# Altium schematic sheet [01] - COVER PAGE.SchDoc: COVER PAGE
size A3; Author: Gabriel Piñango; DocumentNumber: 1; Revision: V1I1; SheetNumber: 1; SheetTotal: 6; Collaborator: Gabriel Pinango; Project: MultiTestcard; VersionRevision: V1I1; Designer: Gabriel Pinango
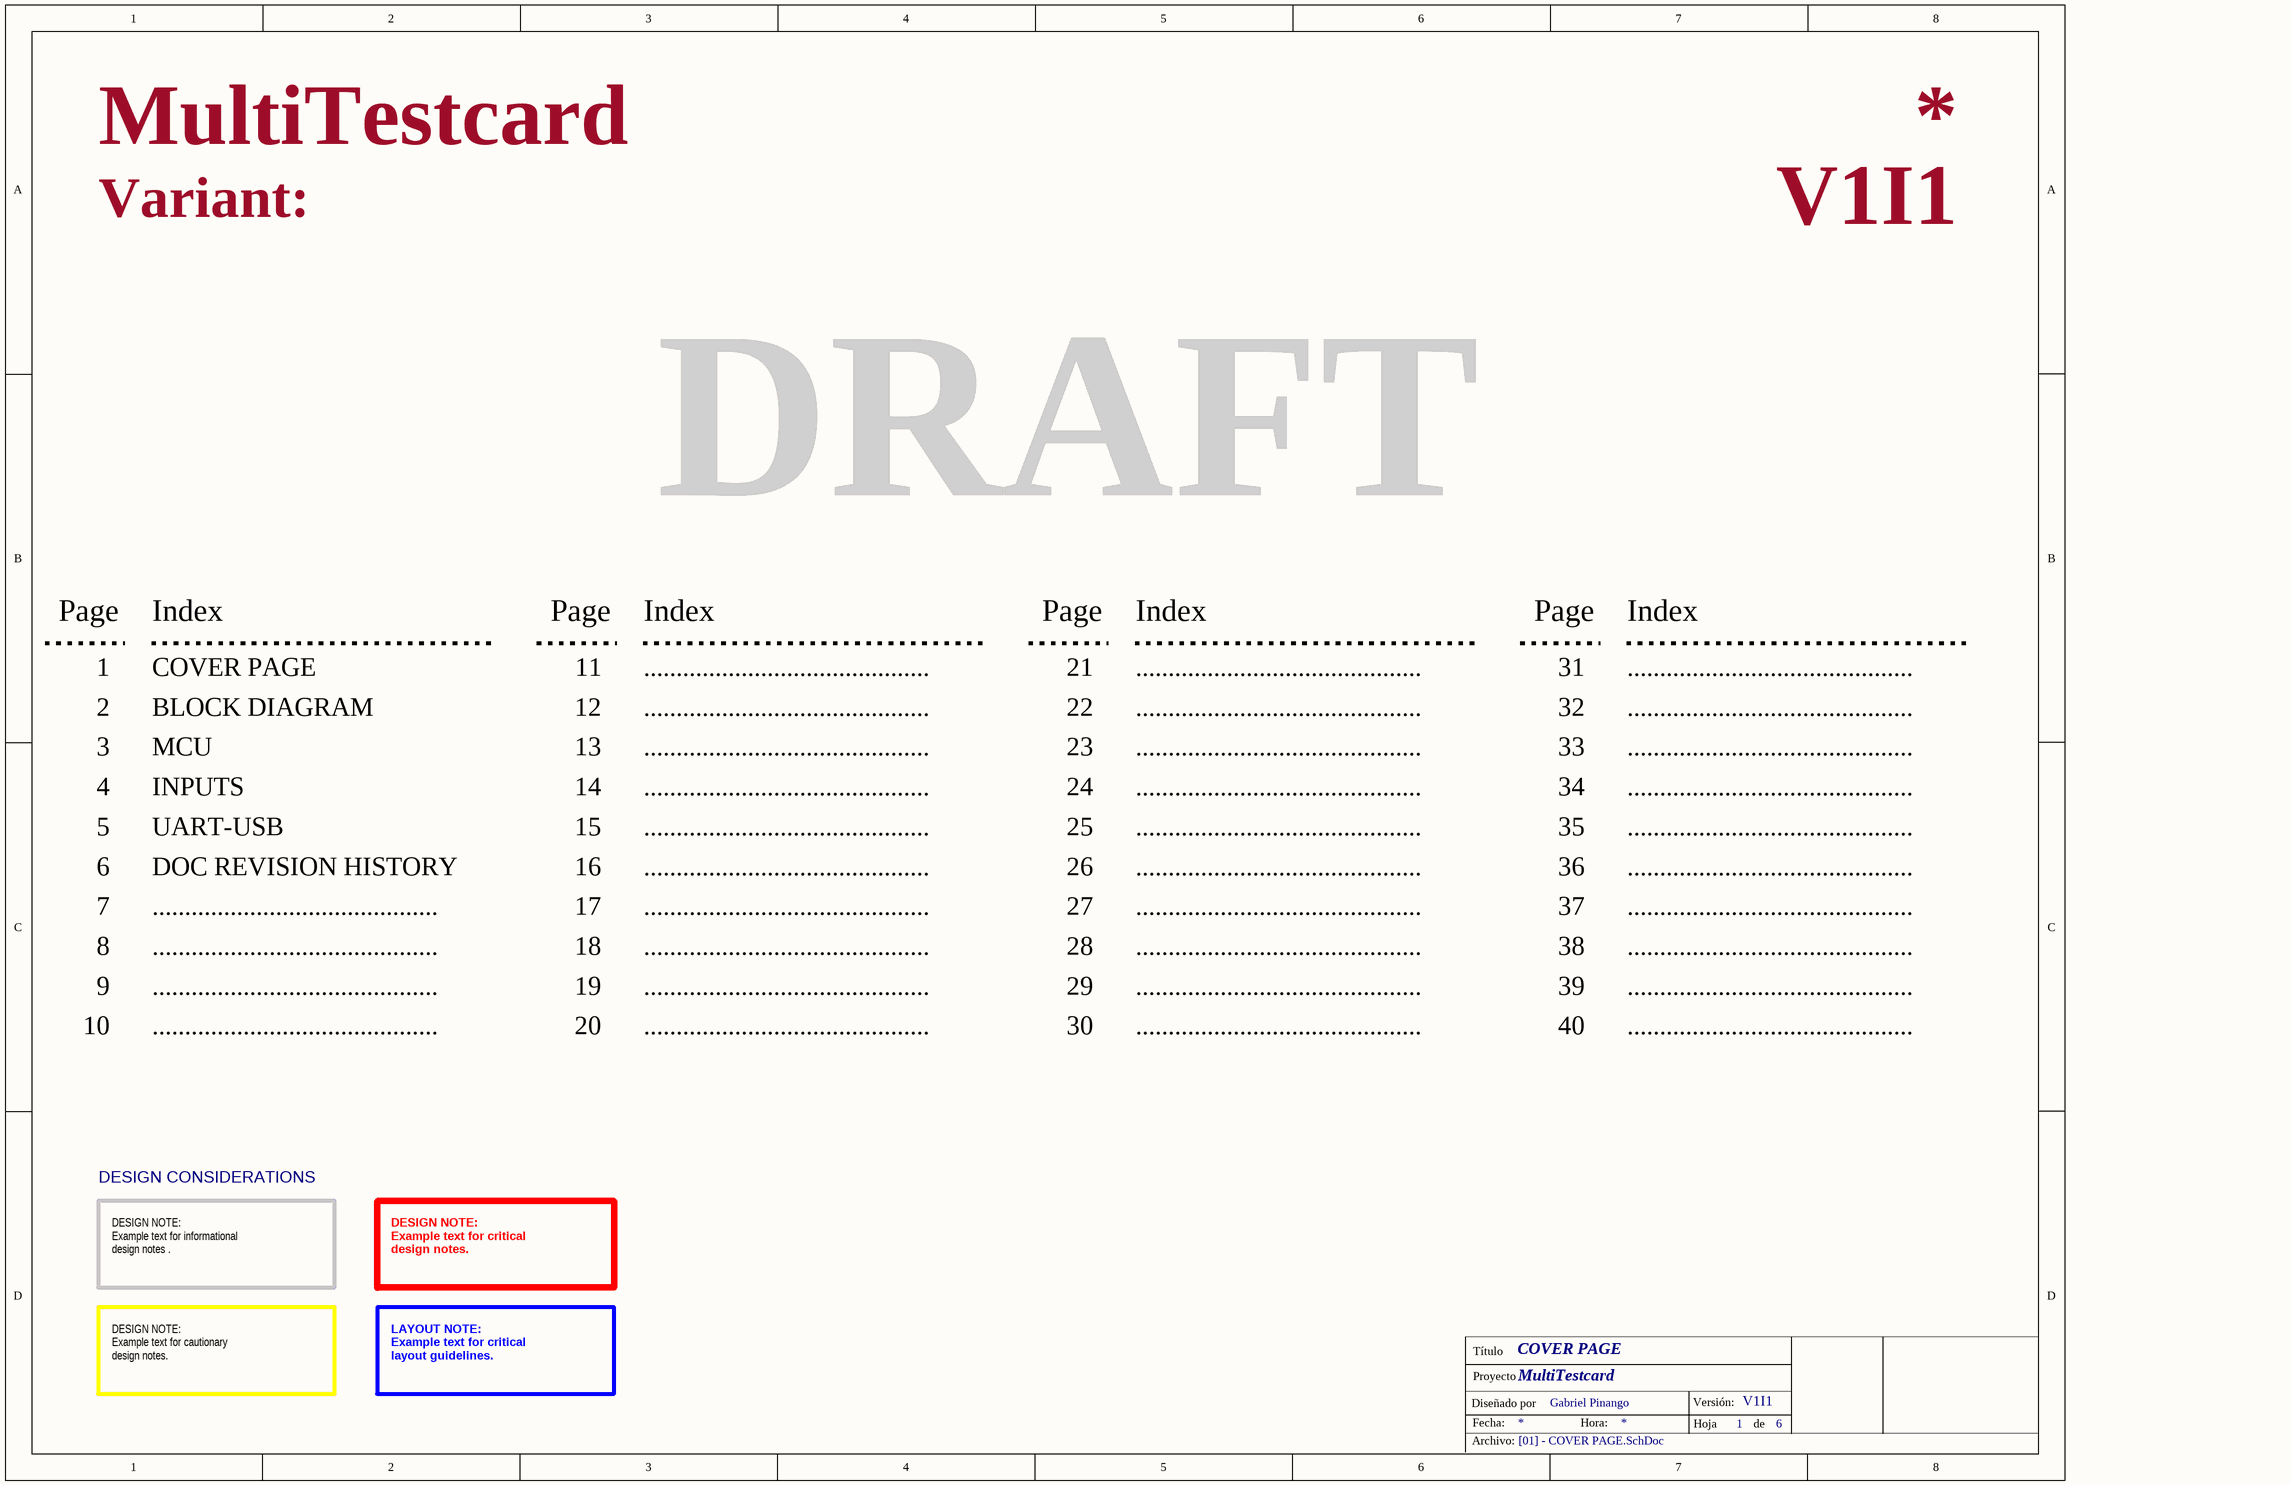
[diagram p0: [01] - COVER PAGE.SchDoc]

## Notes on the sheet
- Variant:
- DRAFT
- Page
- Index
- 1
- COVER PAGE
- 11
- ............................................
- 21
- 31
- 2
- 3
- BLOCK DIAGRAM
- MCU
- 12
- 13
- 22
- 23
- 32
- 33
- 4
- 5
- INPUTS
- UART-USB
- 14
- 15
- 24
- 25
- 34
- 35
- 6
- DOC REVISION HISTORY
- 16
- 26
- 36
- 7
- 8
- 17
- 18
- 27
- 28
- 37
- 38
- 9
- 10
- 19
- 20
- 29
- 30
- 39
- 40
- DESIGN CONSIDERATIONS
- DESIGN NOTE:
  Example text for informational
  design notes .
- DESIGN NOTE:
  Example text for critical
  design notes.
- DESIGN NOTE:
  Example text for cautionary
  design notes.
- LAYOUT NOTE:
  Example text for critical
  layout guidelines.
- Título
- Diseñado por
- Fecha:
- Proyecto
- Hora:
- Versión:
- Hoja
- de
- Archivo: